# Altium schematic sheet Sheet2.SchDoc: Flight Computer Prototype
size A4; Organization: Altium Limited; Address1: L3, 12a Rodborough Rd; Address2: Frenchs Forest; Address3: NSW; Address4: Australia 2086; Revision: 1.0; SheetNumber: 2; SheetTotal: 4
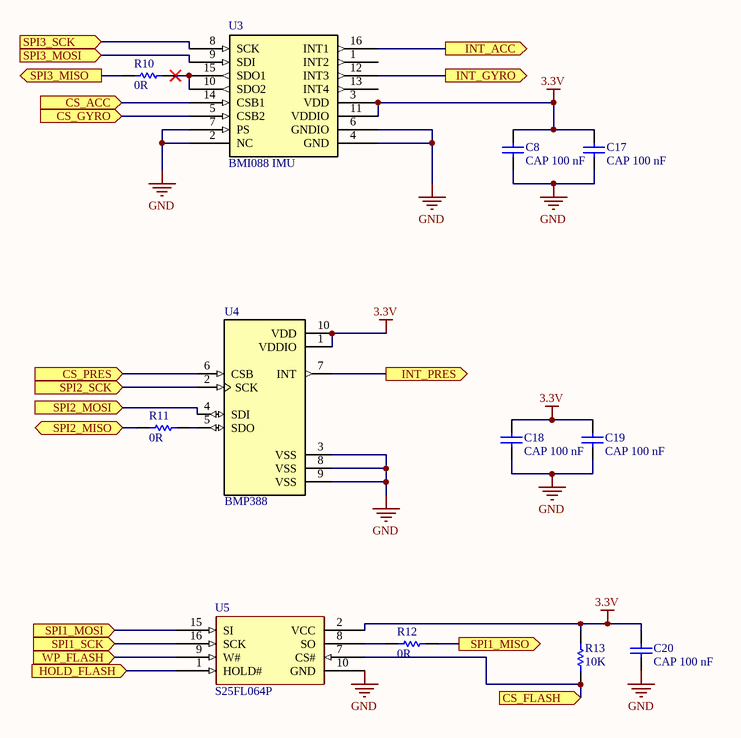
[diagram p0: Sheet2.SchDoc]

## Parts
C8  CAP 100 nF  [06035C104KAT4A]
C17  CAP 100 nF  [06035C104KAT4A]
C18  CAP 100 nF  [06035C104KAT4A]
C19  CAP 100 nF  [06035C104KAT4A]
C20  CAP 100 nF  [06035C104KAT4A]
R10  0R  [CR0603-J/-000ELF]
R11  0R  [CR0603-J/-000ELF]
R12  0R  [CR0603-J/-000ELF]
R13  10K  [RK73H1JTTD1002F]
U3  BMI088 IMU  [BMI088]
U4  BMP388  [*PQFN50P200X200X80-10N]
U5  S25FL064P  [S25FL064P0XMFA000]

## Ports
CS_ACC (in), CS_FLASH (in), CS_GYRO (in), CS_PRES (in), HOLD_FLASH (in), INT_ACC (out), INT_GYRO (out), INT_PRES (out), SPI1_MISO (out), SPI1_MOSI (in), SPI1_SCK (in), SPI2_MISO (bidir), SPI2_MOSI (in), SPI2_SCK (in), SPI3_MISO (out), SPI3_MOSI (in), SPI3_SCK (in), WP_FLASH (in)

## Nets
3.3V: C8.1 C17.1 C18.1 C19.1 C20.1 R13.2 U3.3(VDD) U3.11(VDDIO) U4.1(VDDIO) U4.10(VDD) U5.2(VCC)
GND: C8.2 C17.2 C18.2 C19.2 C20.2 U3.2(NC) U3.4(GND) U3.6(GNDIO) U3.7(PS) U4.3(VSS) U4.8(VSS) U4.9(VSS) U5.10(GND)
CS_ACC: U3.14(CSB1) ; port CS_ACC
CS_FLASH: R13.1 U5.7(CS#) ; port CS_FLASH
CS_GYRO: U3.5(CSB2) ; port CS_GYRO
CS_PRES: U4.6(CSB) ; port CS_PRES
HOLD_FLASH: U5.1(HOLD#) ; port HOLD_FLASH
INT_ACC: U3.16(INT1) ; port INT_ACC
INT_GYRO: U3.12(INT3) ; port INT_GYRO
INT_PRES: U4.7(INT) ; port INT_PRES
SPI1_MISO: R12.2 ; port SPI1_MISO
SPI1_MOSI: U5.15(SI) ; port SPI1_MOSI
SPI1_SCK: U5.16(SCK) ; port SPI1_SCK
SPI2_MISO: R11.1 ; port SPI2_MISO
SPI2_MOSI: U4.4(SDI) ; port SPI2_MOSI
SPI2_SCK: U4.2(SCK) ; port SPI2_SCK
SPI3_MISO: R10.1 ; port SPI3_MISO
SPI3_MOSI: U3.9(SDI) ; port SPI3_MOSI
SPI3_SCK: U3.8(SCK) ; port SPI3_SCK
WP_FLASH: U5.9(W#) ; port WP_FLASH
NetR10_2: R10.2 U3.10(SDO2) U3.15(SDO1)
NetR11_2: R11.2 U4.5(SDO)
NetR12_1: R12.1 U5.8(SO)

Not connected (* = marked no-connect by the designer): U3 1(INT2) 13(INT4)

## Notes on the sheet
- Title
- UMSATS - Rocketry Division
- Designed By:
- Size:
- A4
- Number:
- 01
- Revision:
- Date:
- Time:
- Sheet
- of

## Library data of the parts
C8 C17-C20 = Cap: Capacitor; Published: 8-Jun-2000; LatestRevisionDate: 17-Jul-2002; LatestRevisionNote: Re-released for DXP Platform.; Publisher: Altium Limited
R10-R13 = Res1: Resistor; Value: 1K; Published: 8-Jun-2000; LatestRevisionDate: 17-Jul-2002; LatestRevisionNote: Re-released for DXP Platform.; PackageReference: AXIAL-0.3; Publisher: Altium Limited; PackageDescription: Axial Device, Thru-Hole; 2 Leads; 0.3 in Pin Spacing
U3 = BMI088
U4 = BMP388: P-Sensor SPI I2C 1, 25 Bar SMD; MF: Bosch Sensortec; Package: WFLGA-10 Bosch Tools; SnapEDA_Link: https://www.snapeda.com/parts/BMP388/Bosch%20Sensortec/view-part/?ref=snap; MP: BMP388; Availability: Unavailable; Price: None; Value: *
U5 = S25FL064P: S25FL064P 64 Mb Flash Memory